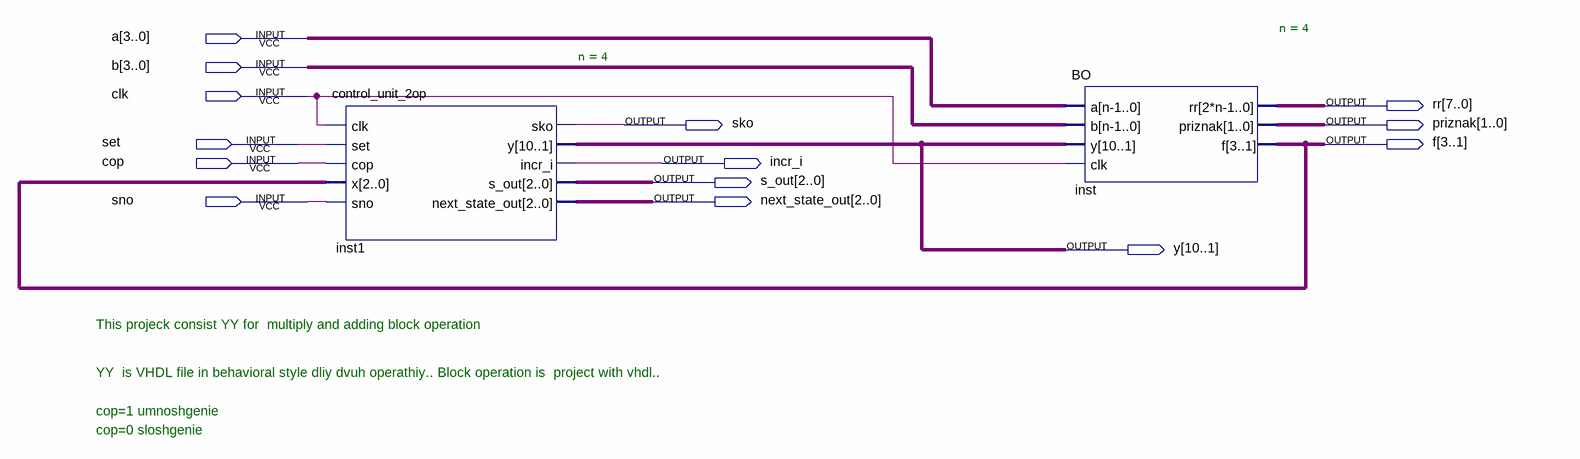
[diagram p0: schematic sheet]
// Quartus schematic alu_new.bdf as structural Verilog: 2 symbols, 14 pins
module alu_new (
  input  [3:0] a,
  input  [3:0] b,
  input  clk,
  input  set,
  input  cop,
  input  sno,
  output [7:0] rr,
  output sko,
  output [1:0] priznak,
  output [3:1] f,
  output incr_i,
  output [2:0] s_out,
  output [2:0] next_state_out,
  output [10:1] y
);

  control_unit_2op #(.n(4)) inst1 (
    .clk(clk), .set(set), .cop(cop), .x(f), .sno(sno), .sko(sko), .y(y), .incr_i(incr_i), .s_out(s_out),
    .next_state_out(next_state_out));
  BO #(.n(4)) inst (.a(a), .b(b), .y(y), .clk(clk), .rr(rr), .priznak(priznak), .f(f));

  // Notes on the sheet:
  //   This projeck consist YY for  multiply and adding block operation
  //   YY  is VHDL file in behavioral style dliy dvuh operathiy.. Block operation is  project with vhdl..
  //   cop=1 umnoshgenie
  //   cop=0 sloshgenie
endmodule
